# Altium schematic sheet HandHeld_Terminal_V2_Rev3.SchDoc
size 774 x 469 mm; SheetNumber: 1; SheetTotal: 1
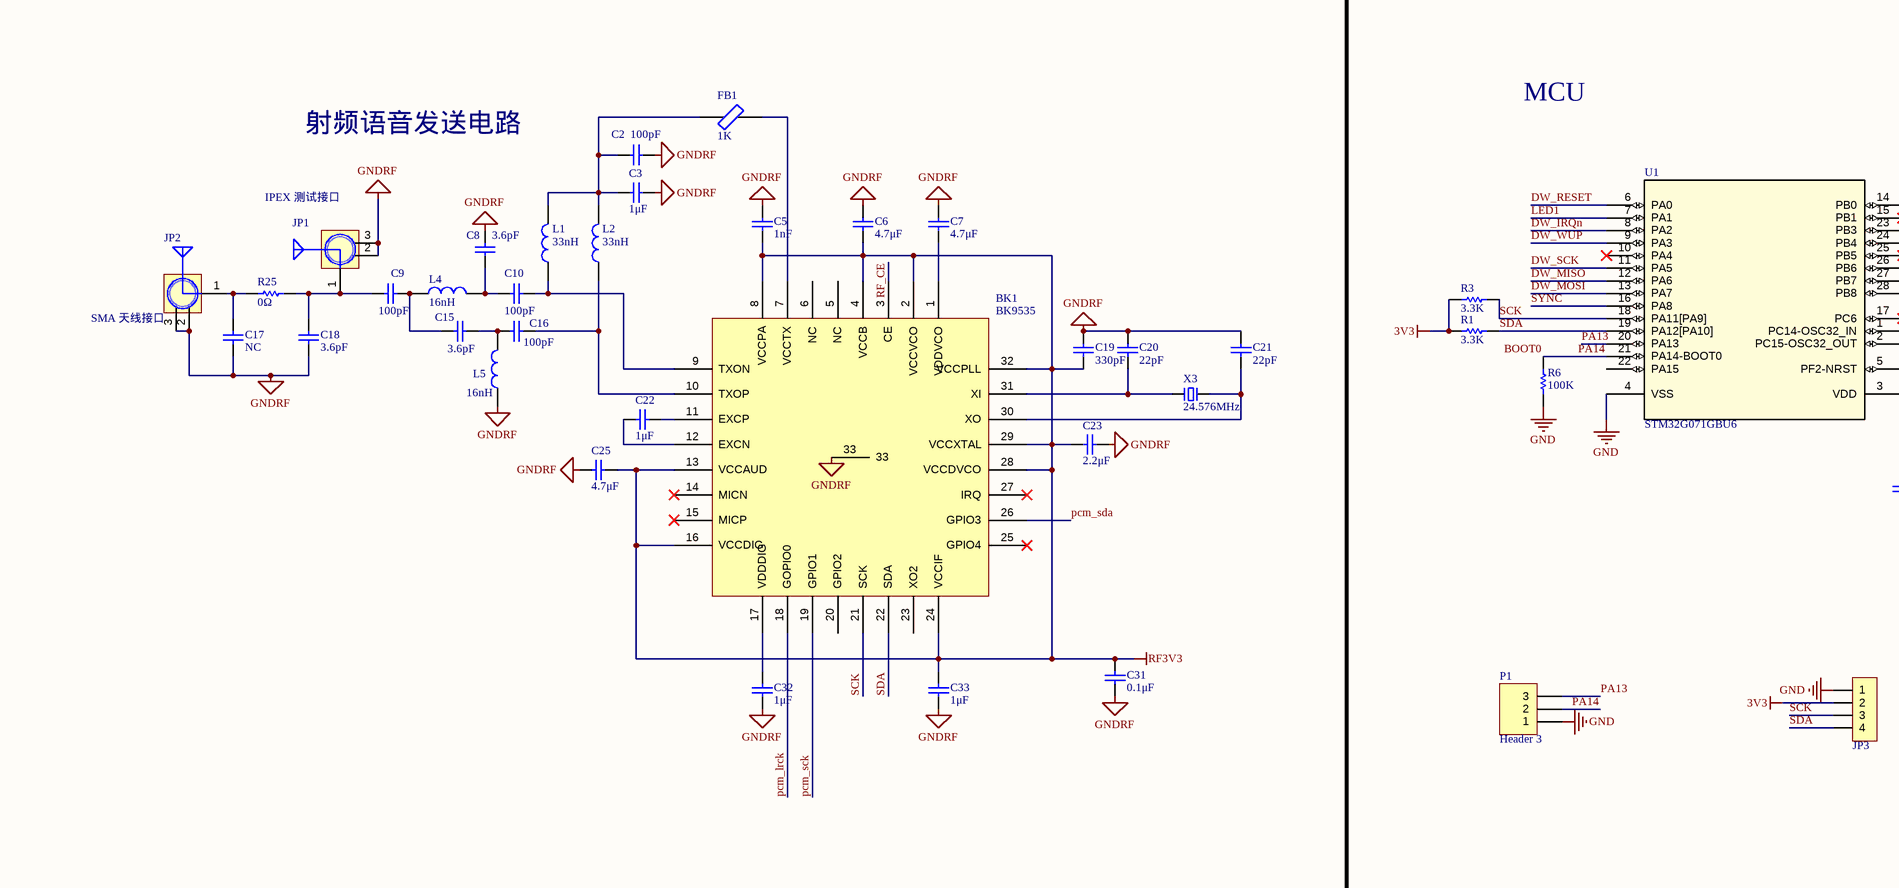
[diagram p0: HandHeld_Terminal_V2_Rev3.SchDoc, top left]
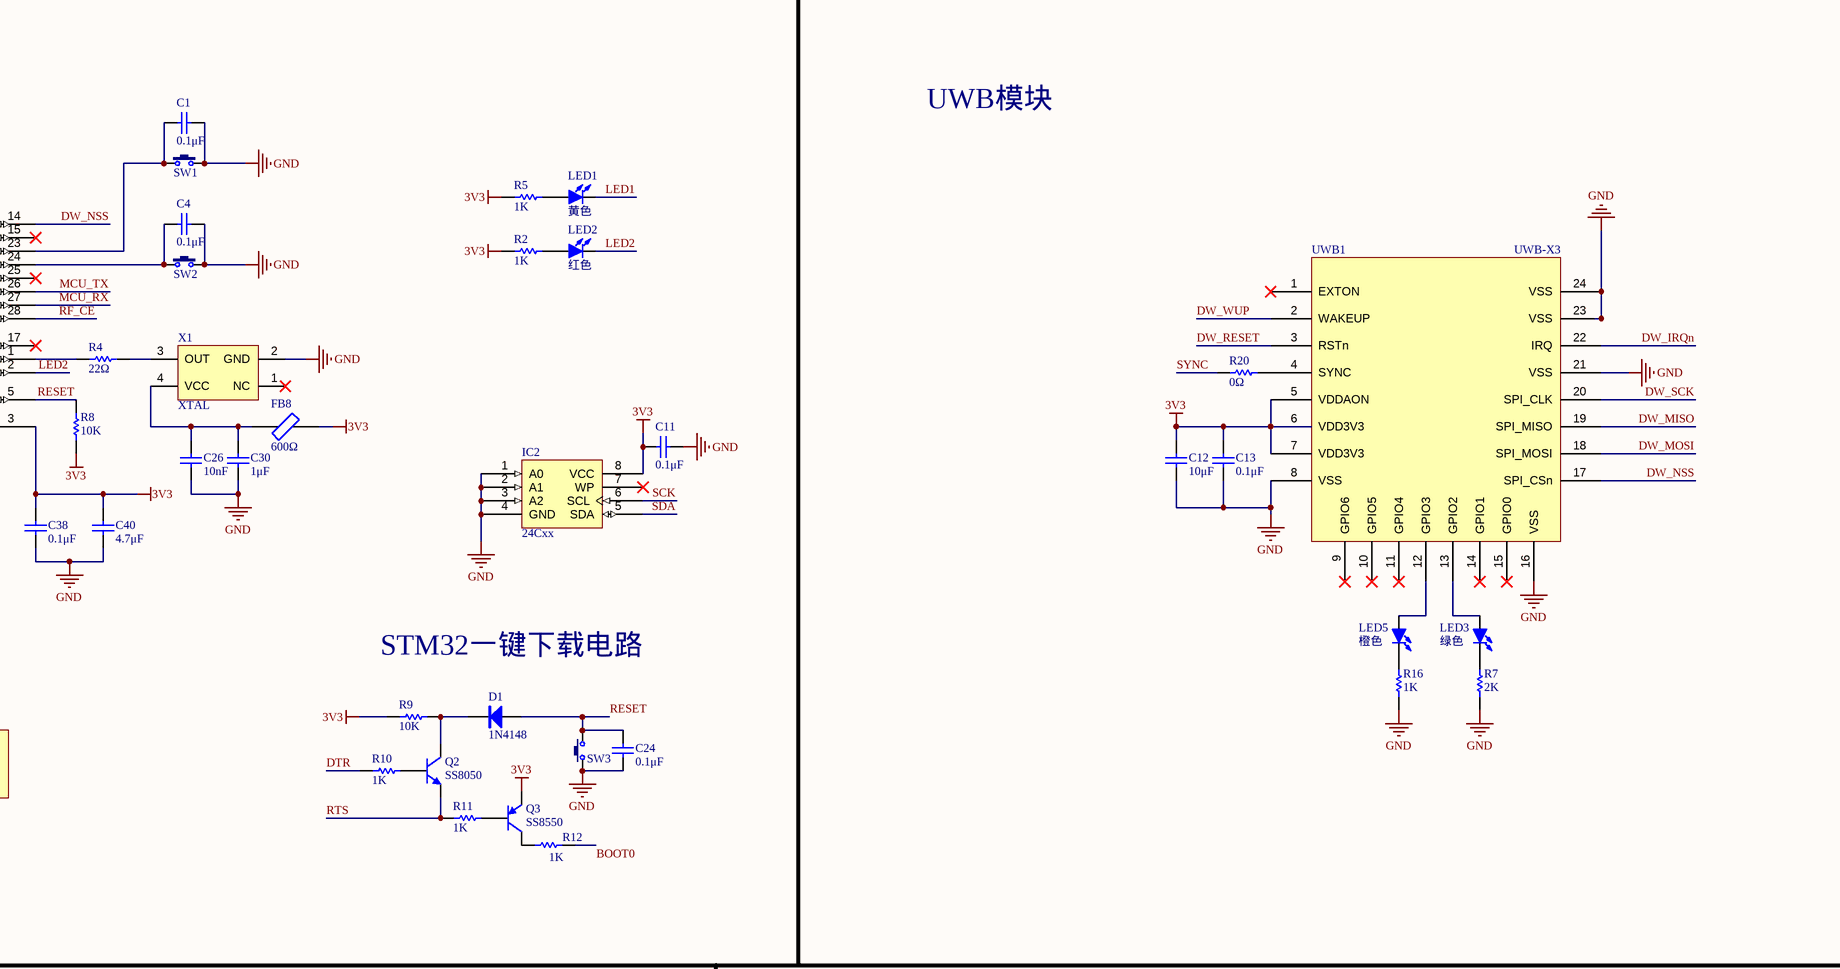
[diagram p1: HandHeld_Terminal_V2_Rev3.SchDoc, top right]
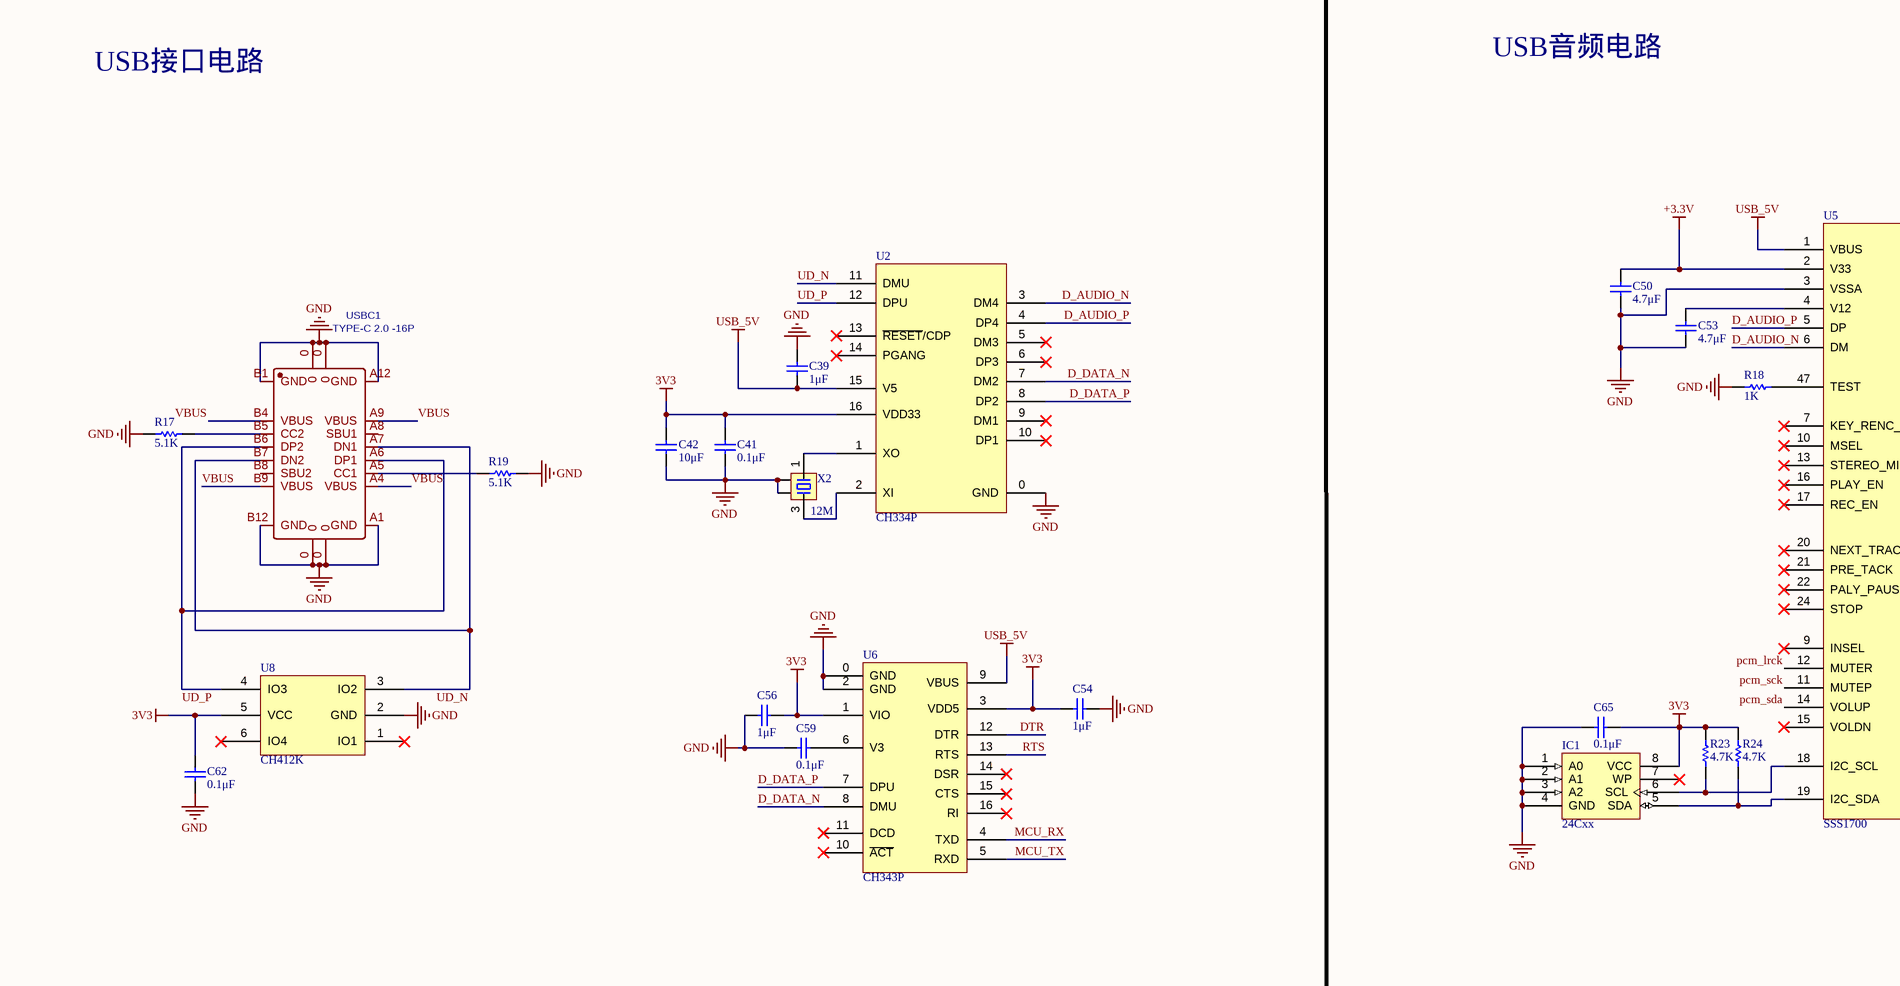
[diagram p2: HandHeld_Terminal_V2_Rev3.SchDoc, bottom left]
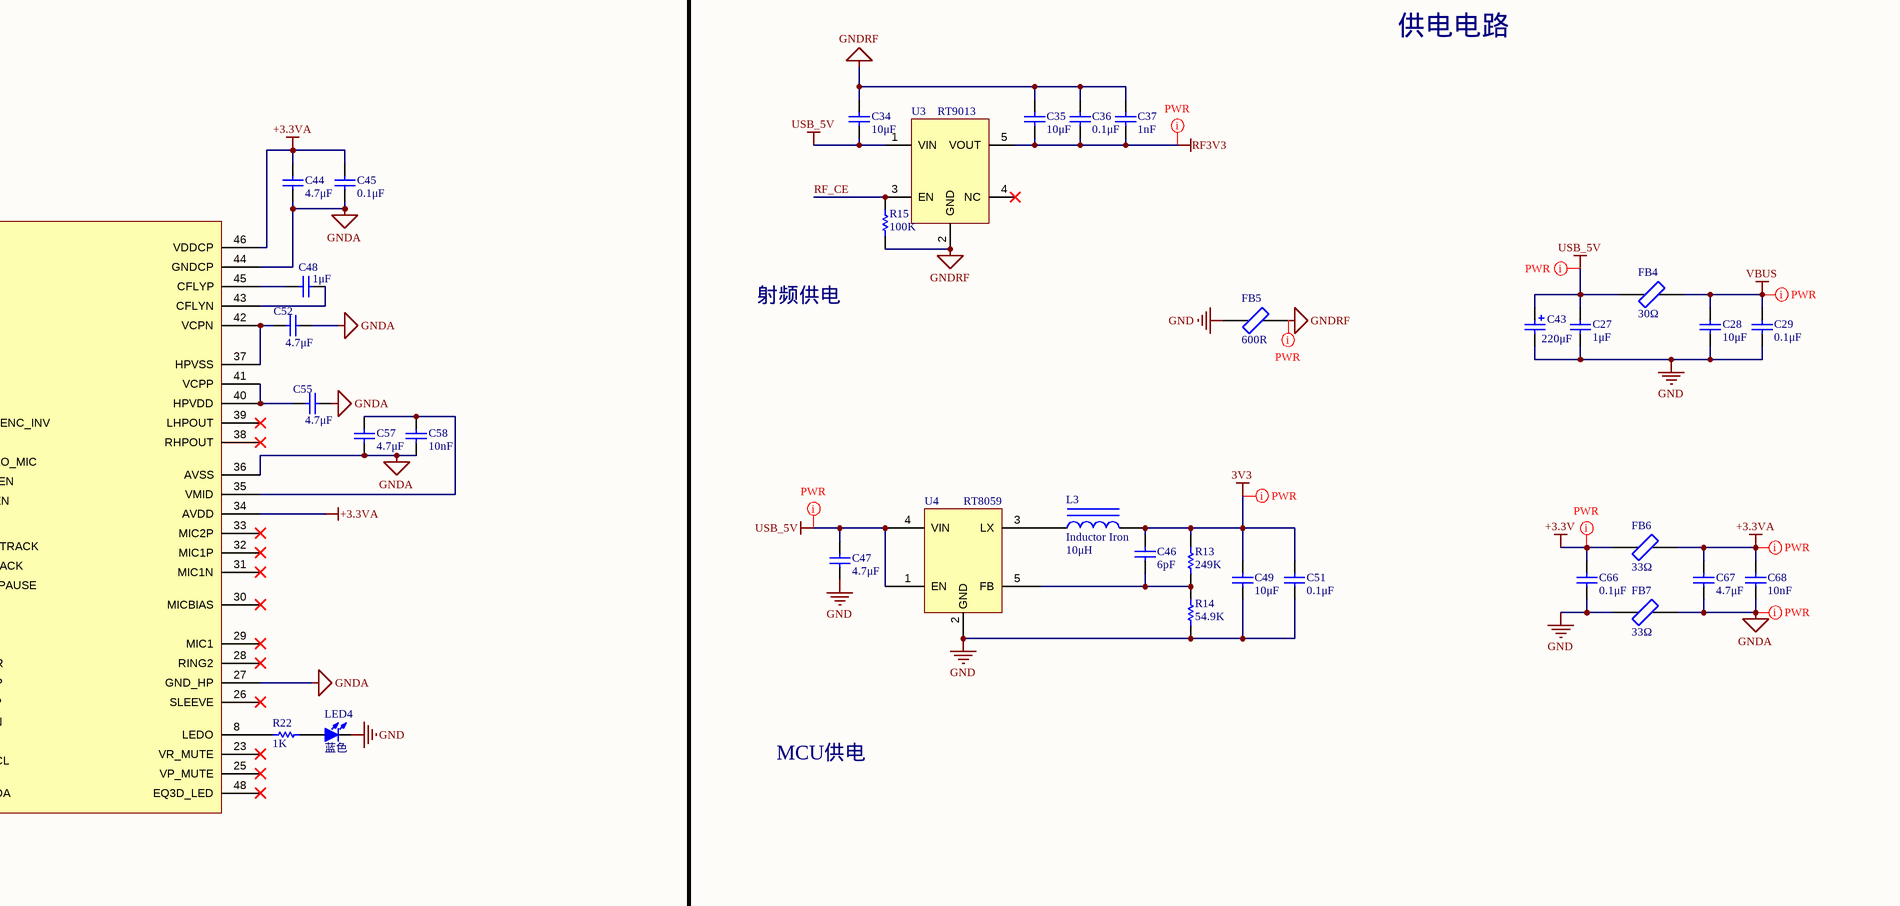
[diagram p3: HandHeld_Terminal_V2_Rev3.SchDoc, bottom right]

## Parts
BK1  BK9535  [QFN32 5x5_N]
C1  value 0.1μF  [C 0603_L]  (hidden comment: Cap)
C2  value 100pF  [C 0603_L]  (hidden comment: Cap)
C3  value 1μF  [C 0603_L]  (hidden comment: Cap)
C4  value 0.1μF  [C 0603_L]  (hidden comment: Cap)
C5  value 1nF  [C 0603_L]  (hidden comment: Cap)
C6  value 4.7μF  [C 0603_L]  (hidden comment: Cap)
C7  value 4.7μF  [C 0603_L]  (hidden comment: Cap)
C8  value 3.6pF  [C 0603_L]  (hidden comment: Cap)
C9  value 100pF  [C 0603_L]  (hidden comment: Cap)
C10  value 100pF  [C 0603_L]  (hidden comment: Cap)
C11  value 0.1μF  [C 0603_L]  (hidden comment: Cap)
C12  value 10μF  [C 0603_L]  (hidden comment: Cap)
C13  value 0.1μF  [C 0603_L]  (hidden comment: Cap)
C15  value 3.6pF  [C 0603_L]  (hidden comment: Cap)
C16  value 100pF  [C 0603_L]  (hidden comment: Cap)
C17  value NC  [C 0603_L]  (hidden comment: Cap)
C18  value 3.6pF  [C 0603_L]  (hidden comment: Cap)
C19  value 330pF  [C 0603_L]  (hidden comment: Cap)
C20  value 22pF  [C 0603_L]  (hidden comment: Cap)
C21  value 22pF  [C 0603_L]  (hidden comment: Cap)
C22  value 1μF  [C 0603_L]  (hidden comment: Cap)
C23  value 2.2μF  [C 0603_L]  (hidden comment: Cap)
C24  value 0.1μF  [C 0603_L]  (hidden comment: Cap)
C25  value 4.7μF  [C 0603_L]  (hidden comment: Cap)
C26  value 10nF  [C 0603_L]  (hidden comment: Cap)
C27  value 1μF  [C 0603_L]  (hidden comment: Cap)
C28  value 10μF  [C 0603_L]  (hidden comment: Cap)
C29  value 0.1μF  [C 0603_L]  (hidden comment: Cap)
C30  value 1μF  [C 0603_L]  (hidden comment: Cap)
C31  value 0.1μF  [C 0603_L]  (hidden comment: Cap)
C32  value 1μF  [C 0603_L]  (hidden comment: Cap)
C33  value 1μF  [C 0603_L]  (hidden comment: Cap)
C34  value 10μF  [C 0603_L]  (hidden comment: Cap)
C35  value 10μF  [C 0603_L]  (hidden comment: Cap)
C36  value 0.1μF  [C 0603_L]  (hidden comment: Cap)
C37  value 1nF  [C 0603_L]  (hidden comment: Cap)
C38  value 0.1μF  [C 0603_L]  (hidden comment: Cap)
C39  value 1μF  [C 0603_L]  (hidden comment: Cap)
C40  value 4.7μF  [C 0603_L]  (hidden comment: Cap)
C41  value 0.1μF  [C 0603_L]  (hidden comment: Cap)
C42  value 10μF  [C 0603_L]  (hidden comment: Cap)
C43  value 220μF  [CM D(6.3*5.4)]  (hidden comment: Cap Pol1)
C44  value 4.7μF  [C 0603_L]  (hidden comment: Cap)
C45  value 0.1μF  [C 0603_L]  (hidden comment: Cap)
C46  value 6pF  [C 0603_L]  (hidden comment: Cap)
C47  value 4.7μF  [C 0603_L]  (hidden comment: Cap)
C48  value 1μF  [C 0603_L]  (hidden comment: Cap)
C49  value 10μF  [C 0603_L]  (hidden comment: Cap)
C50  value 4.7μF  [C 0603_L]  (hidden comment: Cap)
C51  value 0.1μF  [C 0603_L]  (hidden comment: Cap)
C52  value 4.7μF  [C 0603_L]  (hidden comment: Cap)
C53  value 4.7μF  [C 0603_L]  (hidden comment: Cap)
C54  value 1μF  [C 0603_L]  (hidden comment: Cap)
C55  value 4.7μF  [C 0603_L]  (hidden comment: Cap)
C56  value 1μF  [C 0603_L]  (hidden comment: Cap)
C57  value 4.7μF  [C 0603_L]  (hidden comment: Cap)
C58  value 10nF  [C 0603_L]  (hidden comment: Cap)
C59  value 0.1μF  [C 0603_L]  (hidden comment: Cap)
C62  value 0.1μF  [C 0603_L]  (hidden comment: Cap)
C65  value 0.1μF  [C 0603_L]  (hidden comment: Cap)
C66  value 0.1μF  [C 0603_L]  (hidden comment: Cap)
C67  value 4.7μF  [C 0603_L]  (hidden comment: Cap)
C68  value 10nF  [C 0603_L]  (hidden comment: Cap)
D1  1N4148  [SOD-323]
FB1  value 1K  [C 0603_L]  (hidden comment: Ferrite bead)
FB4  value 30Ω  [C 0603_L]  (hidden comment: Ferrite bead)
FB5  value 600R  [C 0805_L]  (hidden comment: Ferrite bead)
FB6  value 33Ω  [C 0603_L]  (hidden comment: Ferrite bead)
FB7  value 33Ω  [C 0603_L]  (hidden comment: Ferrite bead)
FB8  value 600Ω  [C 0603_L]  (hidden comment: Ferrite bead)
IC1  24Cxx  [SOP8_L]
IC2  24Cxx  [SOP8_L]
JP1  IPEX 测试接口  [COAXIAL/SMD/CON/V/I-PEX/W08-5801]
JP2  SMA 天线接口  [SMA-KE]
JP3  HDR-1X4  [HDR2.54-M-LI-4P]  (value not drawn)
L1  value 33nH  [L 0603]  (hidden comment: L)
L2  value 33nH  [L 0603]  (hidden comment: L)
L3  Inductor Iron  value 10μH  [NR4018]
L4  value 16nH  [L 0603]  (hidden comment: L)
L5  value 16nH  [L 0603]  (hidden comment: L)
LED1  黄色  [LED 0805G]
LED2  红色  [LED 0805R]
LED3  绿色  [LED 0805G]
LED4  蓝色  [LED 0805B]
LED5  橙色  [LED 0805G]
P1  Header 3  [HDR2.54-LI-3P]
Q2  SS8050  [SOT-23-3L]
Q3  SS8550  [SOT-23-3L]
R1  value 3.3K  [R 0603_L]  (hidden comment: Resistor)
R2  value 1K  [R 0603_L]  (hidden comment: Resistor)
R3  value 3.3K  [R 0603_L]  (hidden comment: Resistor)
R4  value 22Ω  [R 0603_L]  (hidden comment: Resistor)
R5  value 1K  [R 0603_L]  (hidden comment: Resistor)
R6  value 100K  [R 0603_L]  (hidden comment: Resistor)
R7  value 2K  [R 0603_L]  (hidden comment: Resistor)
R8  value 10K  [R 0603_L]  (hidden comment: Resistor)
R9  value 10K  [R 0603_L]  (hidden comment: Resistor)
R10  value 1K  [R 0603_L]  (hidden comment: Resistor)
R11  value 1K  [R 0603_L]  (hidden comment: Resistor)
R12  value 1K  [R 0603_L]  (hidden comment: Resistor)
R13  value 249K  [R 0603_L]  (hidden comment: Resistor)
R14  value 54.9K  [R 0603_L]  (hidden comment: Resistor)
R15  value 100K  [R 0603_L]  (hidden comment: Resistor)
R16  value 1K  [R 0603_L]  (hidden comment: Resistor)
R17  value 5.1K  [R 0603_L]  (hidden comment: Resistor)
R18  value 1K  [R 0603_L]  (hidden comment: Resistor)
R19  value 5.1K  [R 0603_L]  (hidden comment: Resistor)
R20  value 0Ω  [R 0603_L]  (hidden comment: Resistor)
R22  value 1K  [R 0603_L]  (hidden comment: Resistor)
R23  value 4.7K  [R 0603_L]  (hidden comment: Resistor)
R24  value 4.7K  [R 0603_L]  (hidden comment: Resistor)
R25  value 0Ω  [R 0603_L]  (hidden comment: Resistor)
SW1  3x6x5  [TSW SMD-3*6*2.5]  (value not drawn)
SW2  3x6x5  [TSW SMD-3*6*2.5]  (value not drawn)
SW3  3x6x5  [TSW SMD-3*6*2.5]  (value not drawn)
U1  STM32G071GBU6  [UFQFPN-28]
U2  CH334P  [QFN16]
U3  RT9013  [SOT23-5L]
U4  RT8059  [SOT23-5L]
U5  SSS1700  [LQFP48_L]
U6  CH343P  [QFN16]
U8  CH412K  [SOT-363]
USBC1  TYPE-C 2.0 -16P  [USB-C-SMD_TYPE-C-USB-5]
UWB1  UWB-X3  [UWB-X3-MAX-IPEX]
X1  XTAL  [OSC 3225-4P]
X2  12M  [OSC 3225-4P]
X3  24.576MHz  [OSC 5032-2P]

## Nets
3V3: C11.2 C12.1 C13.1 C38.2 C40.1 C41.1 C42.2 C46.1 C49.1 C51.1 C54.1 C56.2 C62.2 C65.1 FB8.2 IC1.8(VCC) IC2.8(VCC) JP3.2 L3.2 Q3.2(E) R1.1 R2.2 R3.1 R5.2 R8.2 R9.1 R13.2 R23.2 R24.2 U1.3(VDD) U2.16(VDD33) U6.1(VIO) U6.3(VDD5) U8.5(VCC) UWB1.5(VDDAON) UWB1.6(VDD3V3) UWB1.7(VDD3V3)
+3.3V: C50.2 C66.2 FB6.1 U5.2(V33)
+3.3VA: C44.2 C45.2 C67.2 C68.2 FB6.2 U5.34(AVDD) U5.46(VDDCP)
GND: C1.1 C4.1 C11.1 C12.2 C13.2 C24.1 C26.1 C27.1 C28.1 C29.1 C30.1 C38.1 C39.1 C40.2 C41.2 C42.1 C43.2 C47.2 C49.2 C50.1 C51.2 C53.1 C54.2 C56.1 C59.1 C62.1 C65.2 C66.1 FB5.1 FB7.1 IC1.1(A0) IC1.2(A1) IC1.3(A2) IC1.4(GND) IC2.1(A0) IC2.2(A1) IC2.3(A2) IC2.4(GND) JP3.1 LED4.2(K) P1.1 R6.2 R7.2 R14.1 R16.2 R17.2 R18.2 R19.1 SW1.2 SW2.2 SW3.1 U1.4(VSS) U2.0(GND) U4.2(GND) U5.3(VSSA) U6.0(GND) U6.2(GND) U8.2(GND) USBC1.0 USBC1.A1(GND) USBC1.A12(GND) USBC1.B1(GND) USBC1.B12(GND) UWB1.8(VSS) UWB1.16(VSS) UWB1.21(VSS) UWB1.23(VSS) UWB1.24(VSS) X1.2(GND) X2.2 X2.4
GNDA: C44.1 C45.1 C52.1 C55.1 C57.1 C58.1 C67.1 C68.1 FB7.2 U5.27(GND_HP) U5.36(AVSS) U5.44(GNDCP)
GNDRF: BK1.33 C2.1 C3.1 C5.1 C6.1 C7.1 C8.1 C17.2 C18.2 C19.2 C20.2 C21.2 C23.1 C25.2 C31.1 C32.1 C33.1 C34.2 C35.2 C36.2 C37.1 FB5.2 JP1.2(GND) JP1.3(GND) JP2.2(GND) JP2.3(GND) L5.1 R15.1 U3.2(GND)
RF3V3: BK1.2(VCCVCO) BK1.4(VCCB) BK1.8(VCCPA) BK1.13(VCCAUD) BK1.16(VCCDIG) BK1.24(VCCIF) BK1.28(VCCDVCO) BK1.29(VCCXTAL) BK1.32(VCCPLL) C5.2 C6.2 C19.1 C23.2 C25.1 C31.2 C33.2 C35.1 C36.1 C37.2 U3.5(VOUT)
USB_5V: C27.2 C34.1 C39.2 C43.1 C47.1 FB4.1 U2.15(V5) U3.1(VIN) U4.1(EN) U4.4(VIN) U5.1(VBUS) U6.9(VBUS)
VBUS: C28.2 C29.2 FB4.2 USBC1.A4(VBUS) USBC1.A9(VBUS) USBC1.B4(VBUS) USBC1.B9(VBUS)
BOOT0: P1.2 R6.1 R12.2 U1.21(PA14-BOOT0)  [also labelled PA14]
D_AUDIO_N: U2.3(DM4) U5.6(DM)
D_AUDIO_P: U2.4(DP4) U5.5(DP)
D_DATA_N: U2.7(DM2) U6.8(DMU)
D_DATA_P: U2.8(DP2) U6.7(DPU)
DTR: R10.1 U6.12(DTR)
DW_IRQn: U1.8(PA2) UWB1.22(IRQ)
DW_MISO: U1.12(PA6) UWB1.19(SPI_MISO)
DW_MOSI: U1.13(PA7) UWB1.18(SPI_MOSI)
DW_NSS: U1.14(PB0) UWB1.17(SPI_CSn)
DW_RESET: U1.6(PA0) UWB1.3(RSTn)
DW_SCK: U1.11(PA5) UWB1.20(SPI_CLK)
DW_WUP: U1.9(PA3) UWB1.2(WAKEUP)
LED1: LED1.2(K) U1.7(PA1)
LED2: LED2.2(K) U1.2(PC15-OSC32_OUT)
MCU_RX: U1.27(PB7) U6.4(TXD)
MCU_TX: U1.26(PB6) U6.5(RXD)
PA13: P1.3 U1.20(PA13)
pcm_lrck: BK1.18(GOPIO0) U5.12(MUTER)
pcm_sck: BK1.19(GPIO1) U5.11(MUTEP)
pcm_sda: BK1.26(GPIO3) U5.14(VOLUP)
RESET: C24.2 D1.1(A) R8.1 SW3.2 U1.5(PF2-NRST)
RF_CE: BK1.3(CE) R15.2 U1.28(PB8) U3.3(EN)
RTS: Q2.2(E) R11.1 U6.13(RTS)
SCK: BK1.21(SCK) IC2.6(SCL) JP3.3 R3.2 U1.18(PA11[PA9])
SDA: BK1.22(SDA) IC2.5(SDA) JP3.4 R1.2 U1.19(PA12[PA10])
SYNC: R20.1 U1.16(PA8)
UD_N: U2.11(DMU) U8.3(IO2) USBC1.A7(DN1) USBC1.B7(DN2)
UD_P: U2.12(DPU) U8.4(IO3) USBC1.A6(DP1) USBC1.B6(DP2)
NetBK1_1: BK1.1(VDDVCO) C7.2
NetBK1_7: BK1.7(VCCTX) FB1.2
NetBK1_9: BK1.9(TXON) C10.1 L1.1
NetBK1_10: BK1.10(TXOP) C16.1 L2.1
NetBK1_11: BK1.11(EXCP) C22.1
NetBK1_12: BK1.12(EXCN) C22.2
NetBK1_17: BK1.17(VDDDIG) C32.2
NetBK1_30: BK1.30(XO) C21.1 X3.2
NetBK1_31: BK1.31(XI) C20.1 X3.1
NetC1_2: C1.2 SW1.1 U1.23(PB3)
NetC2_2: C2.2 C3.2 FB1.1 L1.2 L2.2
NetC4_2: C4.2 SW2.1 U1.24(PB4)
NetC8_2: C8.2 C10.2 L4.2
NetC9_1: C9.1 C15.2 L4.1
NetC9_2: C9.2 C18.1 JP1.1(ANT) R25.1
NetC15_1: C15.1 C16.2 L5.2
NetC17_1: C17.1 JP2.1(ANT) R25.2
NetC26_2: C26.2 C30.2 FB8.1 X1.4(VCC)
NetC46_2: C46.2 R13.1 R14.2 U4.5(FB)
NetC48_1: C48.1 U5.43(CFLYN)
NetC48_2: C48.2 U5.45(CFLYP)
NetC52_2: C52.2 U5.37(HPVSS) U5.42(VCPN)
NetC53_2: C53.2 U5.4(V12)
NetC55_2: C55.2 U5.40(HPVDD) U5.41(VCPP)
NetC57_2: C57.2 C58.2 U5.35(VMID)
NetC59_2: C59.2 U6.6(V3)
NetD1_2: D1.2(K) Q2.3(C) R9.2
NetIC1_5: IC1.5(SDA) R24.1 U5.19(I2C_SDA)
NetIC1_6: IC1.6(SCL) R23.1 U5.18(I2C_SCL)
NetL3_1: L3.1 U4.3(LX)
NetLED1_1: LED1.1(A) R5.1
NetLED2_1: LED2.1(A) R2.1
NetLED3_1: LED3.1(A) UWB1.13(GPIO2)
NetLED3_2: LED3.2(K) R7.1
NetLED4_1: LED4.1(A) R22.1
NetLED5_1: LED5.1(A) UWB1.12(GPIO3)
NetLED5_2: LED5.2(K) R16.1
NetQ2_1: Q2.1(B) R10.2
NetQ3_1: Q3.1(B) R11.2
NetQ3_3: Q3.3(C) R12.1
NetR4_1: R4.1 U1.1(PC14-OSC32_IN)
NetR4_2: R4.2 X1.3(OUT)
NetR17_1: R17.1 USBC1.B5(CC2)
NetR18_1: R18.1 U5.47(TEST)
NetR19_2: R19.2 USBC1.A5(CC1)
NetR20_2: R20.2 UWB1.4(SYNC)
NetR22_2: R22.2 U5.8(LEDO)
NetU2_1: U2.1(XO) X2.1
NetU2_2: U2.2(XI) X2.3

Not connected (* = marked no-connect by the designer): BK1 5(NC) 6(NC) 14(MICN)* 15(MICP)* 20(GPIO2) 23(XO2) 25(GPIO4)* 27(IRQ)*; IC1 7(WP)*; IC2 7(WP)*; U1 10(PA4)* 15(PB1)* 17(PC6)* 22(PA15) 25(PB5)*; U2 5(DM3)* 6(DP3)* 9(DM1)* 10(DP1)* 13(~{RESET}/CDP)* 14(PGANG)*; U3 4(NC)*; U5 7(KEY_RENC_INV)* 9(INSEL)* 10(MSEL)* 13(STEREO_MIC)* 15(VOLDN)* 16(PLAY_EN)* 17(REC_EN)* 20(NEXT_TRACK)* 21(PRE_TACK)* 22(PALY_PAUSE)* 23(VR_MUTE)* 24(STOP)* 25(VP_MUTE)* 26(SLEEVE)* 28(RING2)* 29(MIC1)* 30(MICBIAS)* 31(MIC1N)* 32(MIC1P)* 33(MIC2P)* 38(RHPOUT)* 39(LHPOUT)* 48(EQ3D_LED)*; U6 10(~{ACT})* 11(DCD)* 14(DSR)* 15(CTS)* 16(RI)*; U8 1(IO1)* 6(IO4)*; USBC1 A8(SBU1) B8(SBU2); UWB1 1(EXTON)* 9(GPIO6)* 10(GPIO5)* 11(GPIO4)* 14(GPIO1)* 15(GPIO0)*; X1 1(NC)*

## Layout directives
net class PWR: 3V3, +3.3V, +3.3VA, GNDA, GNDRF, RF3V3, USB_5V, VBUS

## Notes on the sheet
- 射频语音发送电路
- MCU
- UWB模块
- STM32一键下载电路
- 供电电路
- USB接口电路
- USB音频电路
- 射频供电
- MCU供电
- DWG. NO.
- REV.
- SHT.
- REVISION
- DESCRIPTION
- DATE
- APPROVED
- THIS DOCUMENT AND THE DATA DISCLOSED HEREIN OR HEREWITH IS THE PROPERTY OF ALTIUM LIMITED AND MAY BE FREELY DISTRIBUTED IN WHOLE. NO RIGHTS ARE RESERVED OR EXPRESS OR IMPLIED WARANTEE GIVEN.
- ENG:
- DSN:
- APPROVALS
- PROJECT
- DOCUMENT REVISION:
- DESIGN ITEM:
- CHK:
- BOM:
- REFERENCE DOCUMENTS
- PROJECT REVISION:
- TITLE
- FAB DWG:
- PCB DWG:
- ASSY DWG:
- SCALE:
- SIZE
- D
- CAGE CODE
- FILE NAME
- DWG NO.
- SHEET
- OF
- REV

## Library data of the parts
BK1 = BK9530
C1-C13 C15-C42 C44-C59 C62 C65-C68 = Cap: Capacitor; Published: 8-Jun-2000; LatestRevisionDate: 17-Jul-2002; LatestRevisionNote: Re-released for DXP Platform.; PackageReference: RAD-0.3; Publisher: Altium Limited; PackageDescription: Radial Cap, Thru-Hole; 2 Leads; 0.3 in Pin Spacing
C43 = Cap Pol1: Polarized Capacitor (Radial); Published: 8-Jun-2000; LatestRevisionDate: 17-Jul-2002; LatestRevisionNote: Re-released for DXP Platform.; PackageReference: RB7.6-15; Publisher: Altium Limited
D1 = 1N4148: 开关二极管; BOM名称: 高速开关二极管; 淘宝ID: 封装库来自淘宝 ID：黄晶宝石; 欢迎光临: https://shop463601444.taobao.com
FB1 FB4-FB8 = Ferrite bead: 铁氧体磁珠
IC1 IC2 = 24Cxx: 外置EEPROM; 版权归属: 封装库来自淘宝 ID：黄晶宝石; BOM名称: 外置EEPROM; 唯一出售店铺网址: https://shop463601444.taobao.com
JP1 JP2 = SMA: SMA-2.4G射频天线接口; 版权归属: 封装库来自淘宝 ID：黄晶宝石; BOM名称: SMA-2.4G射频天线接口; 唯一出售店铺网址: https://shop463601444.taobao.com
JP3 = Header 4: 4P接插件; 版权归属: 封装库来自淘宝 ID：黄晶宝石; BOM名称: 4P接插件; 学习资源: https://shop463601444.taobao.com
L1 L2 L4 L5 = L: 小功率贴片电感; 淘宝ID: 封装库来自淘宝 ID：黄晶宝石; 封装库来自淘宝卖家 ID：黄晶宝石: 其他店铺购入均为盗版，不享受售后技术支持服务，请立即申请退款; BOM名称: 小功率贴片电感; 联系售后: https://shop463601444.taobao.com
L3 = Inductor Iron: Magnetic-Core Inductor; Published: 24-Mar-1999; LatestRevisionDate: 17-Jul-2002; LatestRevisionNote: Re-released for DXP Platform.; PackageReference: AXIAL-0.9; Publisher: Altium Limited; PackageDescription: Axial Device, Thru-Hole; 2 Leads; 0.9 in Pin Spacing
LED1-LED5 = LED-SMD: 贴片LED; 版权归属: 封装库来自淘宝 ID：黄晶宝石; BOM名称: 贴片LED; 学习资源: https://shop463601444.taobao.com
P1 = Header 3: Header, 3-Pin; LatestRevisionDate: 17-Jul-2002; LatestRevisionNote: Re-released for DXP Platform.; Publisher: Altium Limited
Q2 = 8050-SMD: 高频放大-NPN型; 版权归属: 封装库来自淘宝 ID：黄晶宝石; 属性: 40V 1.5A 1W 100MHZ; BOM名称: 高频放大-NPN型; 联系售后: https://shop463601444.taobao.com
Q3 = 8550-SMD: 高频放大-PNP型; 版权归属: 封装库来自淘宝 ID：黄晶宝石; 属性: 40V 1.5A 1W 100MHZ; BOM名称: 高频放大-PNP型; 学习资源: www.ooocke.com
SW1-SW3 = TSW 3x6: 3x6轻触开关; 版权归属: 封装库来自淘宝 ID：黄晶宝石; BOM名称: 3x6轻触开关; 学习资源: https://shop463601444.taobao.com
U1 = STM32G071GBU6: No Description Available; Mfr_Name: STMicroelectronics; RefDes: RefDes; Type: Type
U2 = CH334: 4路usb_hub
U3 = RT9013: LDO
U4 = RT8059: DC-DC, 2.8-5.5V,1A
U5 = SSS1700: USB音频芯片
U6 = CH343: USB转串口
U8 = CH412K: 四路ESD保护
USBC1 = USB2.0 Type-C 16Pin母座: USB2.0 Type-C 母座 16Pin; BOM_Manufacturer: LCSC; BOM_Supplier: LCSC; BOM_Manufacturer Part: -; spicePre: U; spiceSymbolName: TYPE-C 3.1 -16P_C168689
UWB1 = UWB-X3(DWM3000)
X1 = XTAL: 4脚有源晶振
X2 = XTAL-4P: 4脚无源晶振; 版权归属: 封装库来自淘宝卖家 ID：黄晶宝石; BOM名称: 4脚无源晶振; 学习资源: https://shop463601444.taobao.com
X3 = XTAL-2P: 2脚无源脚晶振; 版权归属: 封装库来自淘宝卖家 ID：黄晶宝石; BOM名称: 2脚无源脚晶振; 学习资源: https://shop463601444.taobao.com
R1-R20 R22-R25 = Resistor: Published: 8-Jun-2000; LatestRevisionDate: 17-Jul-2002; LatestRevisionNote: Re-released for DXP Platform.; PackageReference: AXIAL-0.5; Publisher: Altium Limited